# EAGLE schematic Newschem (EAGLE 9.3.0)
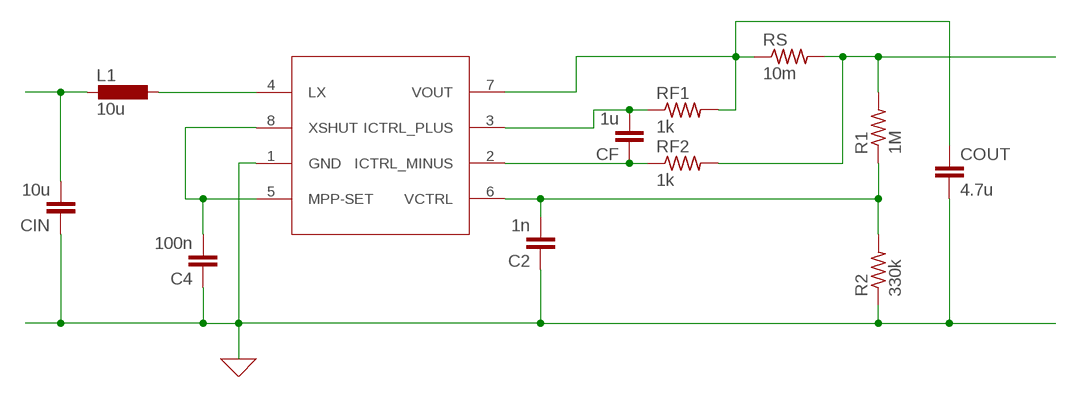
[diagram p0: schematic, sheet 1]

## Parts
C2  1n  C-EU025-025X050  [C025-025X050]
C4  100n  C-EU025-025X050  [C025-025X050]
CF  1u  C-EU025-025X050  [C025-025X050]
CIN  10u  C-EU025-025X050  [C025-025X050]
COUT  4.7u  C-EU025-025X050  [C025-025X050]
L1  10u  DO3316P  [DO3316P]
R1  1M  R-US_0204/2V  [0204V]
R2  330k  R-US_0204/2V  [0204V]
RF1  1k  R-US_0204/2V  [0204V]
RF2  1k  R-US_0204/2V  [0204V]
RS  10m  R-US_0204/2V  [0204V]
U$1  SPV1040  [SOP65P640X120-8N]

## Nets
0: C2.1 C4.1 CIN.1 COUT.2 R2.1 U$1.1(GND) ; supply symbol labelled GND
N$1: L1.2 U$1.4(LX)
N$2: C4.2 U$1.5(MPP-SET) U$1.8(XSHUT)
N$3: CIN.2 L1.1
N$5: C2.2 R1.1 R2.2 U$1.6(VCTRL)
N$6: CF.2 RF1.1 U$1.3(ICTRL_PLUS)
N$7: CF.1 RF2.1 U$1.2(ICTRL_MINUS)
N$8: COUT.1 RF1.2 RS.1 U$1.7(VOUT)
N$9: R1.2 RF2.2 RS.2

## Library data of the parts
C2 C4 CF CIN COUT = rcl:C-EU: CAPACITOR, European symbol; SPICEPREFIX: C
L1 = inductor-coilcraft:DO3316P: COILCRAFT; OC_FARNELL: unknown; OC_NEWARK: unknown
R1 R2 RF1 RF2 RS = resistor:R-US_: RESISTOR, American symbol
U$1 = SPV1040T:SPV1040